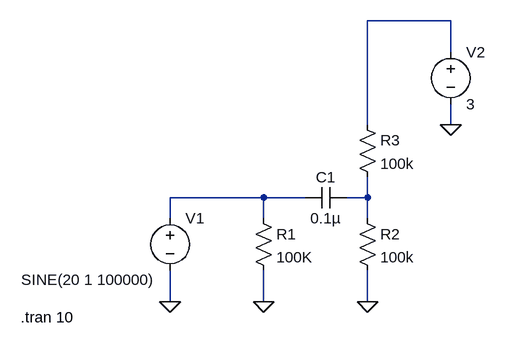
[diagram p0: schematic OscillationLevelShift.asc]
OscillationLevelShift.asc, the LTspice schematic file:
Version 4
SHEET 1 880 680
WIRE 400 -144 272 -144
WIRE 400 -96 400 -144
WIRE 272 16 272 -144
WIRE 400 16 400 -16
WIRE 112 128 -32 128
WIRE 176 128 112 128
WIRE 272 128 272 96
WIRE 272 128 240 128
WIRE -32 160 -32 128
WIRE 112 160 112 128
WIRE 272 160 272 128
WIRE -32 288 -32 240
WIRE 112 288 112 240
WIRE 272 288 272 240
FLAG 112 288 0
FLAG 272 288 0
FLAG 400 16 0
FLAG -32 288 0
SYMBOL res 96 144 R0
SYMATTR InstName R1
SYMATTR Value 100K
SYMBOL res 256 144 R0
SYMATTR InstName R2
SYMATTR Value 100k
SYMBOL res 256 0 R0
SYMATTR InstName R3
SYMATTR Value 100k
SYMBOL cap 240 112 R90
WINDOW 0 0 32 VBottom 2
WINDOW 3 32 32 VTop 2
SYMATTR InstName C1
SYMATTR Value 0.1µ
SYMBOL voltage -32 144 R0
WINDOW 3 -229 110 Left 2
WINDOW 123 0 0 Left 0
WINDOW 39 0 0 Left 0
SYMATTR InstName V1
SYMATTR Value SINE(20 1 100000)
SYMBOL voltage 400 -112 R0
WINDOW 123 0 0 Left 0
WINDOW 39 0 0 Left 0
SYMATTR InstName V2
SYMATTR Value 3
TEXT -262 312 Left 2 !.tran 10

The netlist it stands for:
* OscillationLevelShift.asc
R1 N002 0 100K
R2 N003 0 100k
R3 N001 N003 100k
C1 N003 N002 0.1µ
V1 N002 0 SINE(20 1 100000)
V2 N001 0 3
.tran 10
.backanno
.end